# Altium schematic sheet top-level.SchDoc: SYMA S107 RC HELICOPTER CONTROL
size A; Revision: 0.1
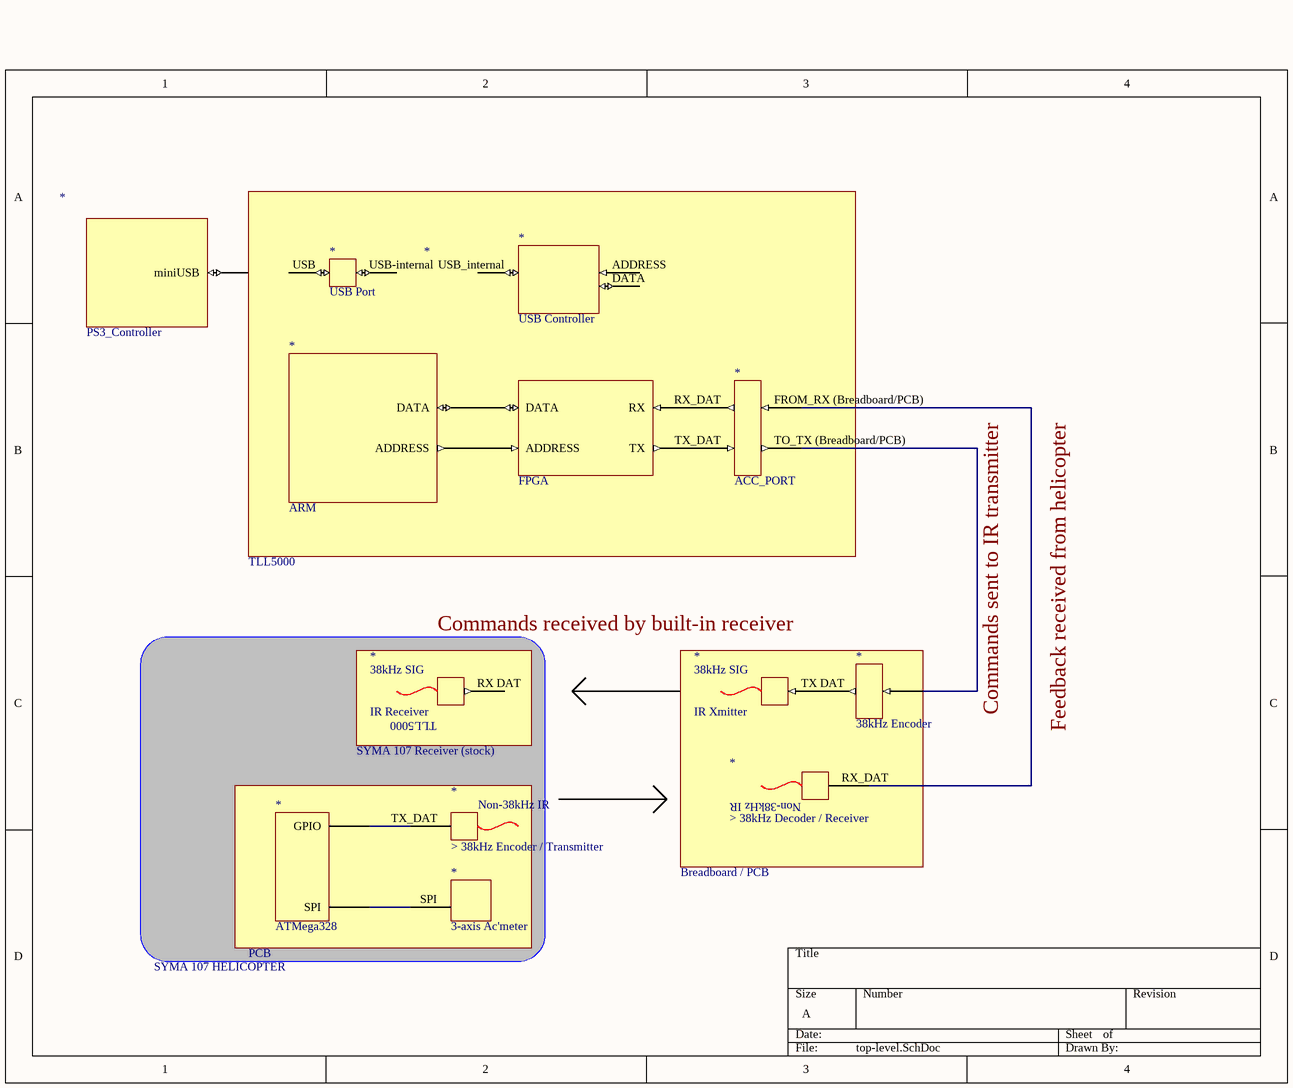
[diagram p0: top-level.SchDoc]

## Parts
(Parts that share a designator on the sheet are numbered #1, #2 ... from top to bottom, then left to right.)
*#1  PS3_Controller
*#2  USB Port
*#3  USB Controller
*#4  ARM
*#5  FPGA
*#6  ACC_PORT
*#7  IR Receiver
*#8  IR Xmitter
*#9  38kHz Encoder
*#10  > 38kHz Decoder / Receiver
*#11  > 38kHz Encoder / Transmitter
*#12  ATMega328
*#13  3-axis Ac'meter

## Blocks framed on the sheet
TLL5000: *#7

## Nets
Net*#4_?1: *#4.?1(ADDRESS) *#5.?2(ADDRESS)
Net*#4_?2: *#4.?2(DATA) *#5.?1(DATA)
Net*#5_?3: *#5.?3(TX) *#6.TX_DAT
Net*#5_?4: *#5.?4(RX) *#6.RX_DAT
Net*#11_TX_DAT: *#11.TX_DAT *#12.10(GPIO)
Net*#12_9: *#12.9(SPI) *#13.SPI

Not connected (* = marked no-connect by the designer): *#1 miniUSB; *#2 USB USB-internal; *#3 ADDRESS DATA USB_internal; *#6 FROM_RX (Breadboard/PCB) TO_TX (Breadboard/PCB); *#7 RX DAT; *#8 TX DAT; *#9 ?1 ?2; *#10 RX_DAT

## Notes on the sheet
- TLL5000
- SYMA 107 Receiver (stock)
- Breadboard / PCB
- SYMA 107 HELICOPTER
- PCB
- Labels drawn without touching a wire or pin: Commands received by built-in receiver, Commands sent to IR transmitter, Feedback received from helicopter
- (in symbol > 38kHz Decoder / Receiver) Non-38kHz IR
- (in symbol > 38kHz Encoder / Transmitter) Non-38kHz IR
- (in symbol IR Receiver) 38kHz SIG
- (in symbol IR Xmitter) 38kHz SIG